# Altium project rocket_main.PrjPcb
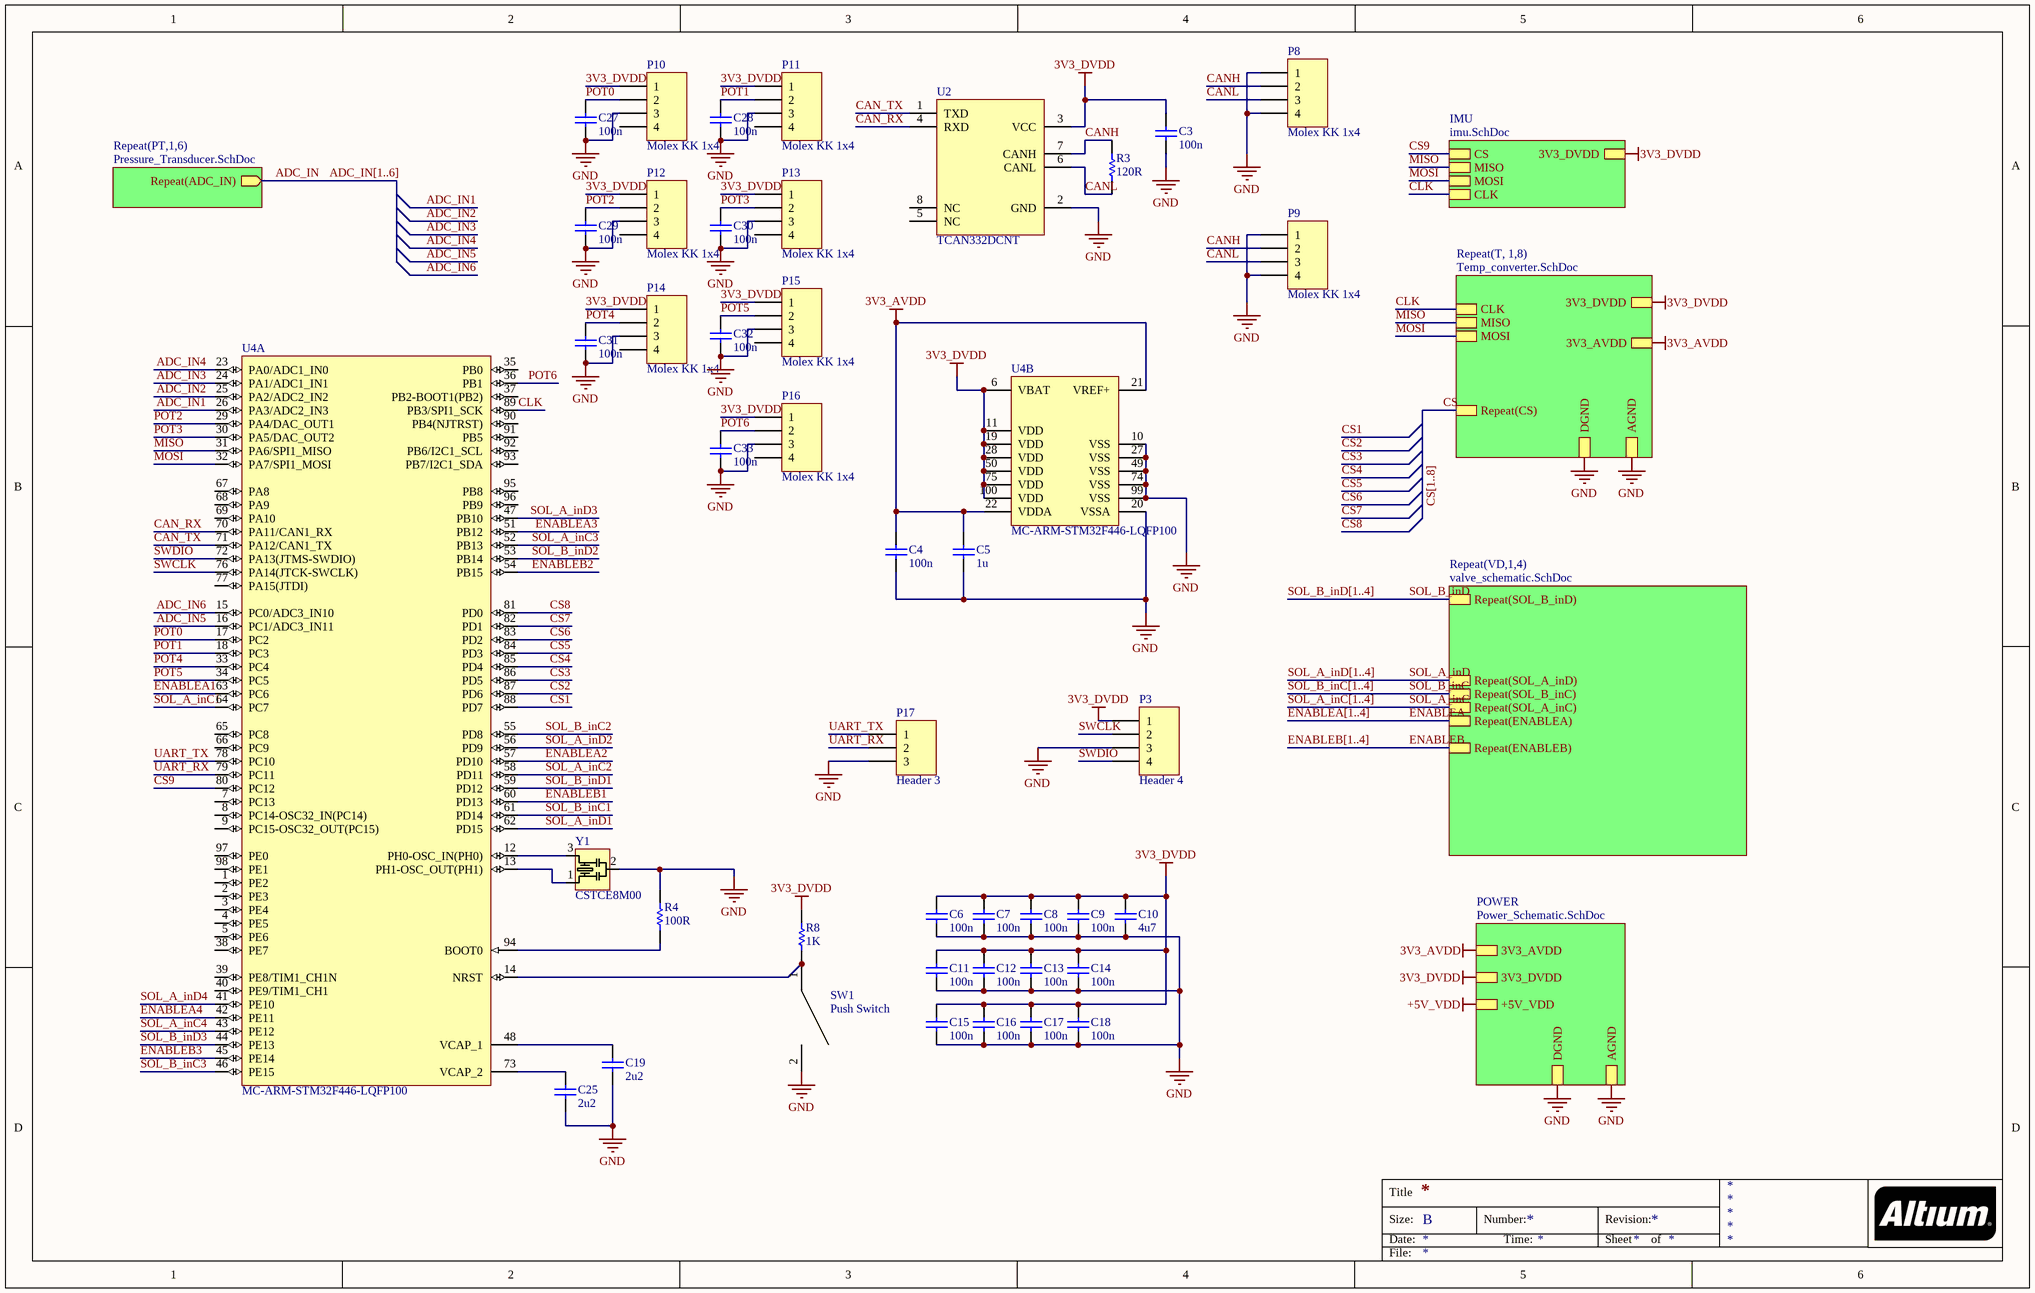
[diagram p0: rocket_main_micro.SchDoc]
6 sheets, 179 parts. Net scope: hierarchical (ports join the sheet entries above them; power ports are global).
Board files: rocket_main.PcbDoc, altiumlogo.PcbDoc
Sheets:
  rocket_main_micro.SchDoc
    T1 = Temp_converter.SchDoc
    T2 = Temp_converter.SchDoc
    T3 = Temp_converter.SchDoc
    T4 = Temp_converter.SchDoc
    T5 = Temp_converter.SchDoc
    T6 = Temp_converter.SchDoc
    T7 = Temp_converter.SchDoc
    T8 = Temp_converter.SchDoc
    PT1 = Pressure_Transducer.SchDoc
    PT2 = Pressure_Transducer.SchDoc
    PT3 = Pressure_Transducer.SchDoc
    PT4 = Pressure_Transducer.SchDoc
    PT5 = Pressure_Transducer.SchDoc
    PT6 = Pressure_Transducer.SchDoc
    VD1 = valve_schematic.SchDoc
    VD2 = valve_schematic.SchDoc
    VD3 = valve_schematic.SchDoc
    VD4 = valve_schematic.SchDoc
    POWER = Power_Schematic.SchDoc
    IMU = imu.SchDoc

## Sheet rocket_main_micro.SchDoc
size B

### Parts
C3  100n  [C0805]
C4  100n  [C0805]
C5  1u  [C0805]
C6  100n  [C0805]
C7  100n  [C0805]
C8  100n  [C0805]
C9  100n  [C0805]
C10  4u7  [C0805]
C11  100n  [C0805]
C12  100n  [C0805]
C13  100n  [C0805]
C14  100n  [C0805]
C15  100n  [C0805]
C16  100n  [C0805]
C17  100n  [C0805]
C18  100n  [C0805]
C19  2u2  [C0805]
C25  2u2  [C0805]
C27  100n  [C0805]
C28  100n  [C0805]
C29  100n  [C0805]
C30  100n  [C0805]
C31  100n  [C0805]
C32  100n  [C0805]
C33  100n  [C0805]
P3  Header 4  [HDR1X4]
P8  Molex KK 1x4  [Molex KK 4x1]
P9  Molex KK 1x4  [Molex KK 4x1]
P10  Molex KK 1x4  [Molex KK 4x1]
P11  Molex KK 1x4  [Molex KK 4x1]
P12  Molex KK 1x4  [Molex KK 4x1]
P13  Molex KK 1x4  [Molex KK 4x1]
P14  Molex KK 1x4  [Molex KK 4x1]
P15  Molex KK 1x4  [Molex KK 4x1]
P16  Molex KK 1x4  [Molex KK 4x1]
P17  Header 3  [HDR1X3]
R3  120R  [R0805]
R4  100R  [R0805]
R8  1K  [R0805]
SW1  Push Switch  [PUSHBUTTON]
U2  TCAN332DCNT  [SOT-23-8]
U4  MC-ARM-STM32F446-LQFP100  [STM-LQFP100_N]  (parts A,B of 2)
Y1  CSTCE8M00  [8MHz Ceramic Resonator]

### Sub-sheets
IMU = imu.SchDoc: CS, 3V3_DVDD, MISO, MOSI, CLK
POWER = Power_Schematic.SchDoc: 3V3_DVDD, 3V3_AVDD, DGND, AGND, +5V_VDD
Repeat(PT,1,6) = Pressure_Transducer.SchDoc: Repeat(ADC_IN) (out)
Repeat(T, 1,8) = Temp_converter.SchDoc: AGND, MOSI, DGND, Repeat(CS), 3V3_DVDD, MISO, 3V3_AVDD, CLK
Repeat(VD,1,4) = valve_schematic.SchDoc: Repeat(SOL_B_inD), Repeat(SOL_A_inD), Repeat(SOL_B_inC), Repeat(SOL_A_inC), Repeat(ENABLEA), Repeat(ENABLEB)

### Nets
3V3_AVDD: C4.1 C5.1 U4.21(VREF+) U4.22(VDDA) ; sheet Repeat(T, 1,8)/3V3_AVDD, sheet POWER/3V3_AVDD
3V3_DVDD: C3.1 C6.1 C7.1 C8.1 C9.1 C10.1 C11.1 C12.1 C13.1 C14.1 C15.1 C16.1 C17.1 C18.1 P3.1 P10.1 P11.1 P12.1 P13.1 P14.1 P15.1 P16.1 R8.2 U2.3(VCC) U4.6(VBAT) U4.11(VDD) U4.19(VDD) U4.28(VDD) U4.50(VDD) U4.75(VDD) U4.100(VDD) ; sheet Repeat(T, 1,8)/3V3_DVDD, sheet POWER/3V3_DVDD, sheet IMU/3V3_DVDD
GND: C3.2 C4.2 C5.2 C6.2 C7.2 C8.2 C9.2 C10.2 C11.2 C12.2 C13.2 C14.2 C15.2 C16.2 C17.2 C18.2 C19.2 C25.2 C27.2 C28.2 C29.2 C30.2 C31.2 C32.2 C33.2 P3.3 P8.1 P8.4 P9.1 P9.4 P10.3 P11.3 P12.3 P13.3 P14.3 P15.3 P16.3 P17.3 R4.2 SW1.2 U2.2(GND) U4.10(VSS) U4.20(VSSA) U4.27(VSS) U4.49(VSS) U4.74(VSS) U4.99(VSS) Y1.2(GND) ; sheet Repeat(T, 1,8)/AGND, sheet Repeat(T, 1,8)/DGND, sheet POWER/DGND, sheet POWER/AGND
ADC_IN: sheet Repeat(PT,1,6)/Repeat(ADC_IN)
ADC_IN1: U4.26(PA3/ADC2_IN3)
ADC_IN2: U4.25(PA2/ADC2_IN2)
ADC_IN3: U4.24(PA1/ADC1_IN1)
ADC_IN4: U4.23(PA0/ADC1_IN0)
ADC_IN5: U4.16(PC1/ADC3_IN11)
ADC_IN6: U4.15(PC0/ADC3_IN10)
CAN_RX: U2.4(RXD) U4.70(PA11/CAN1_RX)
CAN_TX: U2.1(TXD) U4.71(PA12/CAN1_TX)
CANH: P8.2 P9.2 R3.2 U2.7(CANH)
CANL: P8.3 P9.3 R3.1 U2.6(CANL)
CLK: U4.89(PB3/SPI1_SCK) ; sheet Repeat(T, 1,8)/CLK, sheet IMU/CLK
CS: sheet Repeat(T, 1,8)/Repeat(CS)
CS1: U4.88(PD7)
CS2: U4.87(PD6)
CS3: U4.86(PD5)
CS4: U4.85(PD4)
CS5: U4.84(PD3)
CS6: U4.83(PD2)
CS7: U4.82(PD1)
CS8: U4.81(PD0)
CS9: U4.80(PC12) ; sheet IMU/CS
ENABLEA: sheet Repeat(VD,1,4)/Repeat(ENABLEA)
ENABLEA1: U4.63(PC6)  [project net ENABLEA]
ENABLEA2: U4.57(PD10)  [project net ENABLEA]
ENABLEA3: U4.51(PB12)  [project net ENABLEA]
ENABLEA4: U4.42(PE11)  [project net ENABLEA]
ENABLEB: sheet Repeat(VD,1,4)/Repeat(ENABLEB)
ENABLEB1: U4.60(PD13)  [project net ENABLEB]
ENABLEB2: U4.54(PB15)  [project net ENABLEB]
ENABLEB3: U4.45(PE14)  [project net ENABLEB]
MISO: U4.31(PA6/SPI1_MISO) ; sheet Repeat(T, 1,8)/MISO, sheet IMU/MISO
MOSI: U4.32(PA7/SPI1_MOSI) ; sheet Repeat(T, 1,8)/MOSI, sheet IMU/MOSI
POT0: C27.1 P10.2 U4.17(PC2)
POT1: C28.1 P11.2 U4.18(PC3)
POT2: C29.1 P12.2 U4.29(PA4/DAC_OUT1)
POT3: C30.1 P13.2 U4.30(PA5/DAC_OUT2)
POT4: C31.1 P14.2 U4.33(PC4)
POT5: C32.1 P15.2 U4.34(PC5)
POT6: C33.1 P16.2 U4.36(PB1)
SOL_A_inC: sheet Repeat(VD,1,4)/Repeat(SOL_A_inC)
SOL_A_inC1: U4.64(PC7)  [project net SOL_A_inC]
SOL_A_inC2: U4.58(PD11)  [project net SOL_A_inC]
SOL_A_inC3: U4.52(PB13)  [project net SOL_A_inC]
SOL_A_inC4: U4.43(PE12)  [project net SOL_A_inC]
SOL_A_inD: sheet Repeat(VD,1,4)/Repeat(SOL_A_inD)
SOL_A_inD1: U4.62(PD15)  [project net SOL_A_inD]
SOL_A_inD2: U4.56(PD9)  [project net SOL_A_inD]
SOL_A_inD3: U4.47(PB10)  [project net SOL_A_inD]
SOL_A_inD4: U4.41(PE10)  [project net SOL_A_inD]
SOL_B_inC: sheet Repeat(VD,1,4)/Repeat(SOL_B_inC)
SOL_B_inC1: U4.61(PD14)  [project net SOL_B_inC]
SOL_B_inC2: U4.55(PD8)  [project net SOL_B_inC]
SOL_B_inC3: U4.46(PE15)  [project net SOL_B_inC]
SOL_B_inD: sheet Repeat(VD,1,4)/Repeat(SOL_B_inD)
SOL_B_inD1: U4.59(PD12)  [project net SOL_B_inD]
SOL_B_inD2: U4.53(PB14)  [project net SOL_B_inD]
SOL_B_inD3: U4.44(PE13)  [project net SOL_B_inD]
SWCLK: P3.2 U4.76(PA14(JTCK-SWCLK))
SWDIO: P3.4 U4.72(PA13(JTMS-SWDIO))
UART_RX: P17.2 U4.79(PC11)
UART_TX: P17.1 U4.78(PC10)
NetC19_1: C19.1 U4.48(VCAP_1)
NetC25_1: C25.1 U4.73(VCAP_2)
NetR4_1: R4.1 U4.94(BOOT0)
NetR8_1: R8.1 SW1.1 U4.14(NRST)
NetU4_12: U4.12(PH0-OSC_IN(PH0)) Y1.3(OSC2)
NetU4_13: U4.13(PH1-OSC_OUT(PH1)) Y1.1(OSC1)

Not connected (* = marked no-connect by the designer): P10 4; P11 4; P12 4; P13 4; P14 4; P15 4; P16 4; U2 5(NC) 8(NC); U4 1(PE2) 2(PE3) 3(PE4) 4(PE5) 5(PE6) 7(PC13) 8(PC14-OSC32_IN(PC14)) 9(PC15-OSC32_OUT(PC15)) 35(PB0) 37(PB2-BOOT1(PB2)) 38(PE7) 39(PE8/TIM1_CH1N) 40(PE9/TIM1_CH1) 65(PC8) 66(PC9) 67(PA8) 68(PA9) 69(PA10) 77(PA15(JTDI)) 90(PB4(NJTRST)) 91(PB5) 92(PB6/I2C1_SCL) 93(PB7/I2C1_SDA) 95(PB8) 96(PB9) 97(PE0) 98(PE1)

### Buses and harness runs
bus ADC_IN[1..6]
bus CS[1..8]
bus ENABLEA[1..4]
bus ENABLEB[1..4]
bus SOL_A_inC[1..4]
bus SOL_A_inD[1..4]
bus SOL_B_inC[1..4]
bus SOL_B_inD[1..4]

### Notes on the sheet
- Title
- Size:
- Date:
- B
- Number:
- Time:
- Revision:
- Sheet
- of
- File:

### Library data of the parts
C3-C19 C25 C27-C33 = C0805: 0805 Capacitor
  C3 C4 C6-C9 C11-C18 C27-C33: Value: 100n
  C5: Value: 1u
  C10: Value: 4u7
  C19 C25: Value: 2u2
P3 = Header 4: Header, 4-Pin; LatestRevisionDate: 17-Jul-2002; LatestRevisionNote: Re-released for DXP Platform.; Publisher: Altium Limited
P8-P16 = Molex KK 1x4: 1x4 Molex KK Connector
P17 = Header 3: Header, 3-Pin; LatestRevisionDate: 17-Jul-2002; LatestRevisionNote: Re-released for DXP Platform.; Publisher: Altium Limited
R3 R4 R8 = R0805: RESISTOR 0805
  R3: Value: 120R
  R4: Value: 100R
  R8: Value: 1K
SW1 = PUSHBUTTON
U2 = TCAN332DCNT: IC TXRX CAN 3.3V SOT23-8
Y1 = CSTCE8M00: 8MHz Ceramic Resonator

## Sheet Temp_converter.SchDoc
size A
Used 8 times, as channels T1, T2, T3, T4, T5, T6, T7, T8. Parts and nets are listed once, with the designators drawn on the sheet.
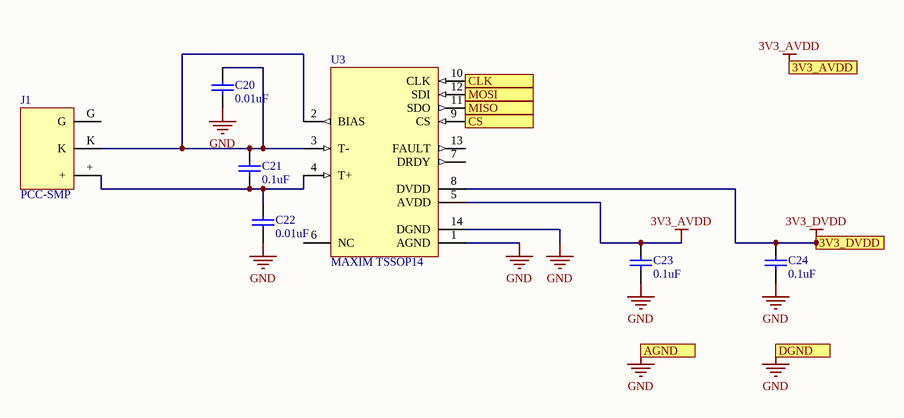
[diagram p1: Temp_converter.SchDoc]

### Parts
C20  0.01uF  [C0805]
C21  0.1uF  [C0805]
C22  0.01uF  [C0805]
C23  0.1uF  [C0805]
C24  0.1uF  [C0805]
J1  PCC-SMP  [PCC-SMP]
U3  MAXIM TSSOP14  [MAXIM TSSOP14]

### Ports
3V3_AVDD, 3V3_DVDD, AGND, CLK, CS, DGND, MISO, MOSI

### Nets
3V3_AVDD: C23.1 U3.5(AVDD) ; port 3V3_AVDD
3V3_DVDD: C24.1 U3.8(DVDD) ; port 3V3_DVDD
GND: C20.2 C22.2 C23.2 C24.2 U3.1(AGND) U3.14(DGND) ; port AGND, port DGND
CLK: U3.10(CLK) ; port CLK
CS: U3.9(CS) ; port CS
MISO: U3.11(SDO) ; port MISO
MOSI: U3.12(SDI) ; port MOSI
NetC20_1: C20.1 C21.1 J1.K U3.2(BIAS) U3.3(T-)
NetC21_2: C21.2 C22.1 J1.+ U3.4(T+)

Not connected (* = marked no-connect by the designer): J1 G; U3 6(NC) 7(DRDY) 13(FAULT)

### Channels
T1: designators end in _T1; ports 3V3_AVDD=3V3_AVDD 3V3_DVDD=3V3_DVDD AGND=GND CLK=CLK CS=CS1 DGND=GND MISO=MISO MOSI=MOSI
T2: designators end in _T2; ports 3V3_AVDD=3V3_AVDD 3V3_DVDD=3V3_DVDD AGND=GND CLK=CLK CS=CS2 DGND=GND MISO=MISO MOSI=MOSI
T3: designators end in _T3; ports 3V3_AVDD=3V3_AVDD 3V3_DVDD=3V3_DVDD AGND=GND CLK=CLK CS=CS3 DGND=GND MISO=MISO MOSI=MOSI
T4: designators end in _T4; ports 3V3_AVDD=3V3_AVDD 3V3_DVDD=3V3_DVDD AGND=GND CLK=CLK CS=CS4 DGND=GND MISO=MISO MOSI=MOSI
T5: designators end in _T5; ports 3V3_AVDD=3V3_AVDD 3V3_DVDD=3V3_DVDD AGND=GND CLK=CLK CS=CS5 DGND=GND MISO=MISO MOSI=MOSI
T6: designators end in _T6; ports 3V3_AVDD=3V3_AVDD 3V3_DVDD=3V3_DVDD AGND=GND CLK=CLK CS=CS6 DGND=GND MISO=MISO MOSI=MOSI
T7: designators end in _T7; ports 3V3_AVDD=3V3_AVDD 3V3_DVDD=3V3_DVDD AGND=GND CLK=CLK CS=CS7 DGND=GND MISO=MISO MOSI=MOSI
T8: designators end in _T8; ports 3V3_AVDD=3V3_AVDD 3V3_DVDD=3V3_DVDD AGND=GND CLK=CLK CS=CS8 DGND=GND MISO=MISO MOSI=MOSI

### Library data of the parts
C20-C24 = C0805: 0805 Capacitor
  C20 C22: Value: 0.01uF
  C21 C23 C24: Value: 0.1uF
J1 = PCC-SMP: THERMOCOUPLE CONNECTOR

## Sheet Pressure_Transducer.SchDoc
size A
Used 6 times, as channels PT1, PT2, PT3, PT4, PT5, PT6. Parts and nets are listed once, with the designators drawn on the sheet.
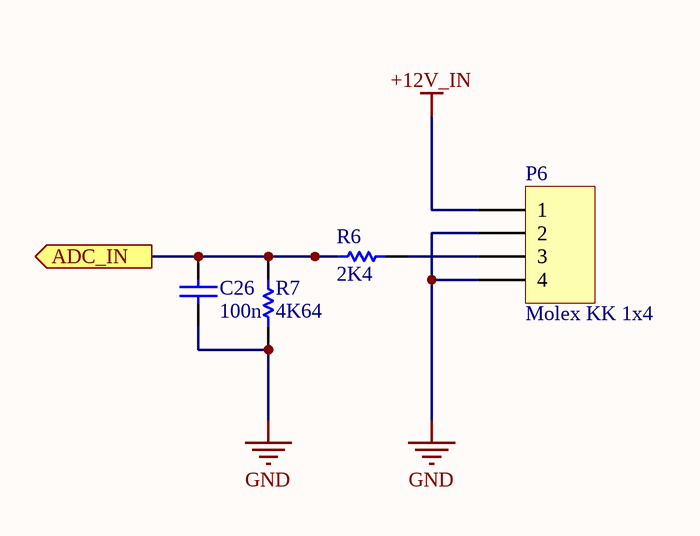
[diagram p2: Pressure_Transducer.SchDoc]

### Parts
C26  100n  [C0805]
P6  Molex KK 1x4  [Molex KK 4x1]
R6  2K4  [R0805]
R7  4K64  [R0805]

### Ports
ADC_IN (out)

### Nets
+12V_IN: P6.1
GND: C26.2 P6.2 P6.4 R7.1
ADC_IN: C26.1 R6.2 R7.2 ; port ADC_IN
NetP6_3: P6.3 R6.1

### Channels
PT1: designators end in _PT1; ports ADC_IN=ADC_IN1
PT2: designators end in _PT2; ports ADC_IN=ADC_IN2
PT3: designators end in _PT3; ports ADC_IN=ADC_IN3
PT4: designators end in _PT4; ports ADC_IN=ADC_IN4
PT5: designators end in _PT5; ports ADC_IN=ADC_IN5
PT6: designators end in _PT6; ports ADC_IN=ADC_IN6

### Library data of the parts
C26 = C0805: 0805 Capacitor; Value: 100n
P6 = Molex KK 1x4: 1x4 Molex KK Connector
R6 R7 = R0805: RESISTOR 0805
  R6: Value: 2K4
  R7: Value: 4K64

## Sheet valve_schematic.SchDoc
size A
Used 4 times, as channels VD1, VD2, VD3, VD4. Parts and nets are listed once, with the designators drawn on the sheet.
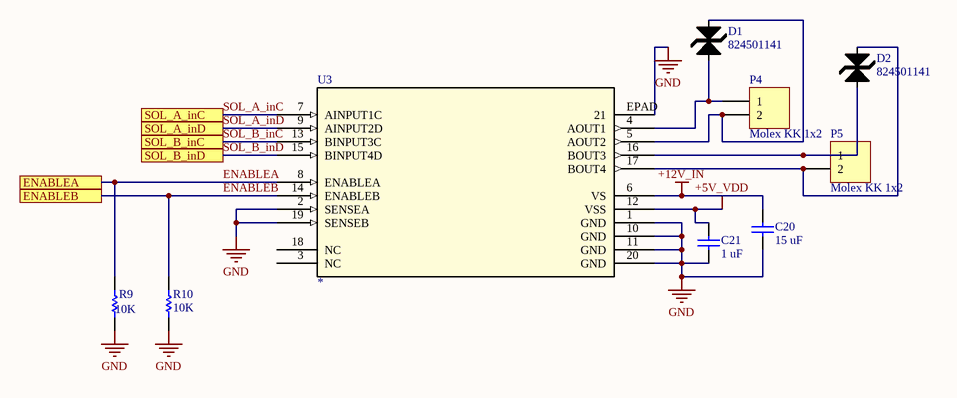
[diagram p3: valve_schematic.SchDoc]

### Parts
C20  15 uF  [C0603]
C21  1 uF  [C0603]
D1  824501141  [DIODE-SMA]
D2  824501141  [DIODE-SMA]
P4  Molex KK 1x2  [Molex KK 2x1]
P5  Molex KK 1x2  [Molex KK 2x1]
R9  10K  [R0805]
R10  10K  [R0805]
U3  *  [PowerSO-20]

### Ports
ENABLEA, ENABLEB, SOL_A_inC, SOL_A_inD, SOL_B_inC, SOL_B_inD

### Nets
+5V_VDD: C21.1 U3.12(VSS)
+12V_IN: C20.1 U3.6(VS)
GND: C20.2 C21.2 R9.1 R10.1 U3.1(GND) U3.2(SENSEA) U3.10(GND) U3.11(GND) U3.19(SENSEB) U3.20(GND) U3.EPAD(21)
ENABLEA: R9.2 U3.8(ENABLEA) ; port ENABLEA
ENABLEB: R10.2 U3.14(ENABLEB) ; port ENABLEB
SOL_A_inC: U3.7(AINPUT1C) ; port SOL_A_inC
SOL_A_inD: U3.9(AINPUT2D) ; port SOL_A_inD
SOL_B_inC: U3.13(BINPUT3C) ; port SOL_B_inC
SOL_B_inD: U3.15(BINPUT4D) ; port SOL_B_inD
NetD1_A: D1.A P4.1 U3.4(AOUT1)
NetD1_K: D1.K P4.2 U3.5(AOUT2)
NetD2_A: D2.A P5.1 U3.16(BOUT3)
NetD2_K: D2.K P5.2 U3.17(BOUT4)

Not connected (* = marked no-connect by the designer): U3 3(NC) 18(NC)

### Channels
VD1: designators end in _VD1; ports ENABLEA=ENABLEA ENABLEB=ENABLEB SOL_A_inC=SOL_A_inC SOL_A_inD=SOL_A_inD SOL_B_inC=SOL_B_inC SOL_B_inD=SOL_B_inD
VD2: designators end in _VD2; ports ENABLEA=ENABLEA ENABLEB=ENABLEB SOL_A_inC=SOL_A_inC SOL_A_inD=SOL_A_inD SOL_B_inC=SOL_B_inC SOL_B_inD=SOL_B_inD
VD3: designators end in _VD3; ports ENABLEA=ENABLEA ENABLEB=ENABLEB SOL_A_inC=SOL_A_inC SOL_A_inD=SOL_A_inD SOL_B_inC=SOL_B_inC SOL_B_inD=SOL_B_inD
VD4: designators end in _VD4; ports ENABLEA=ENABLEA ENABLEB=ENABLEB_VD4 SOL_A_inC=SOL_A_inC SOL_A_inD=SOL_A_inD SOL_B_inC=SOL_B_inC_VD4 SOL_B_inD=SOL_B_inD_VD4

### Library data of the parts
C20 C21 = C0603: 0603 Capacitor
  C20: Value: 15 uF
  C21: Value: 1 uF
D1 D2 = 824501141: TVS DIODE 14V 23.2V DO214AC; Supplier 1: Digi-Key; Supplier Part Number 1: SMCJ120CABTR-ND
P4 P5 = Molex KK 1x2: 1x2 Molex KK Connector
R9 R10 = R0805: RESISTOR 0805; Value: 10K
U3 = L298P013TR: Imported; Vendor: ST Microelectronics; Built_By: EMA_UL_Team; C: Copyright (C) 2015 Accelerated Designs. All rights reserved; Manufacturer_Part_Number: L298P013TR; Value: Value; Type: Type; RefDes: RefDes

## Sheet Power_Schematic.SchDoc
size A
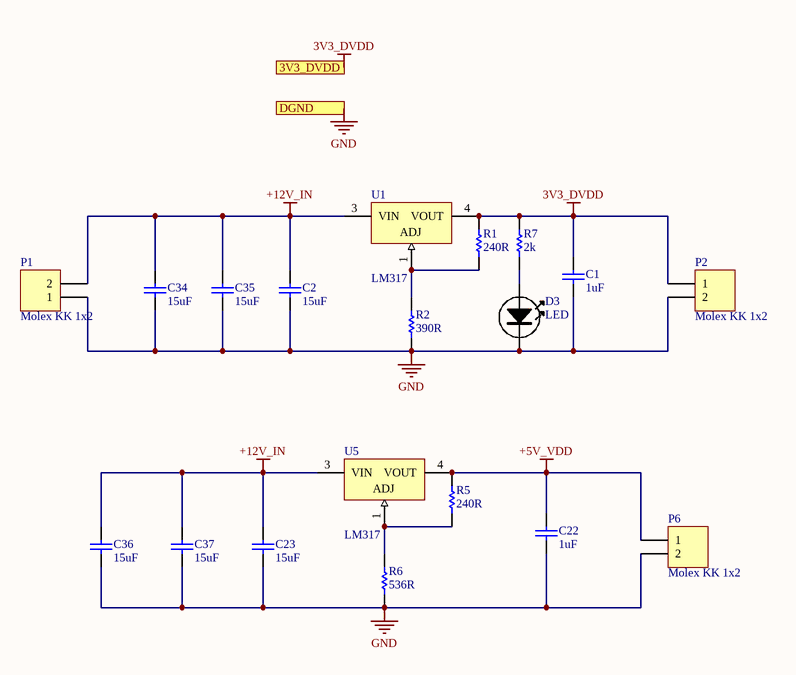
[diagram p4: Power_Schematic.SchDoc]

### Parts
C1  1uF  [C0805]
C2  15uF  [C0805]
C22  1uF  [C0805]
C23  15uF  [C0805]
C34  15uF  [C0805]
C35  15uF  [C0805]
C36  15uF  [C0805]
C37  15uF  [C0805]
D3  LED  [0805LED]
P1  Molex KK 1x2  [Molex KK 2x1]
P2  Molex KK 1x2  [Molex KK 2x1]
P6  Molex KK 1x2  [Molex KK 2x1]
R1  240R  [R0805]
R2  390R  [R0805]
R5  240R  [R0805]
R6  536R  [R0805]
R7  2k  [R0805]
U1  LM317  [D-PAK]
U5  LM317  [D-PAK]

### Ports
3V3_DVDD, DGND

### Nets
3V3_DVDD: C1.1 P2.1 R1.2 R7.2 U1.4(VOUT) ; port 3V3_DVDD
+5V_VDD: C22.1 P6.1 R5.2 U5.4(VOUT)
+12V_IN: C2.1 C23.1 C34.1 C35.1 C36.1 C37.1 P1.2 U1.3(VIN) U5.3(VIN)
GND: C1.2 C2.2 C22.2 C23.2 C34.2 C35.2 C36.2 C37.2 D3.K P1.1 P2.2 P6.2 R2.1 R6.1 ; port DGND
NetD3_A: D3.A R7.1
NetR1_1: R1.1 R2.2 U1.1(ADJ)
NetR5_1: R5.1 R6.2 U5.1(ADJ)

### Library data of the parts
C1 C2 C22 C23 C34-C37 = C0805: 0805 Capacitor
  C1 C22: Value: 1uF
  C2 C23 C34-C37: Value: 15uF
D3 = LED: Manufacturer: OSRAM Opto Semiconductors Inc; Manufacturer Part Number: LS T676-Q1R2-1-Z; Reel: D13
P1 P2 P6 = Molex KK 1x2: 1x2 Molex KK Connector
R1 R2 R5-R7 = R0805: RESISTOR 0805
  R1 R5: Value: 240R
  R2: Value: 390R
  R6: Value: 536R
  R7: Value: 2k
U1 U5 = LM317: Linear Voltage Regulator

## Sheet imu.SchDoc
size A
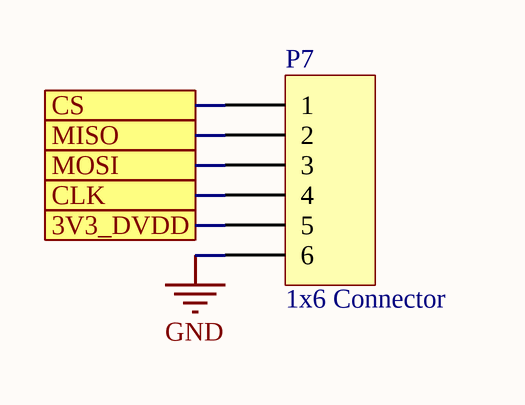
[diagram p5: imu.SchDoc]

### Parts
P7  1x6 Connector  [Molex KK 6x1]

### Ports
3V3_DVDD, CLK, CS, MISO, MOSI

### Nets
3V3_DVDD: P7.5 ; port 3V3_DVDD
GND: P7.6
CLK: P7.4 ; port CLK
CS9: P7.1 ; port CS
MISO: P7.2 ; port MISO
MOSI: P7.3 ; port MOSI

### Library data of the parts
P7 = Molex KK 1x6: 1x6 Molex KK Connector

## Nets that join several sheets
3V3_AVDD: rocket_main_micro (C4.1 C5.1 U4.21 U4.22), T1 (C23_T1.1 U3_T1.5), T2 (C23_T2.1 U3_T2.5), T3 (C23_T3.1 U3_T3.5), T4 (C23_T4.1 U3_T4.5), T5 (C23_T5.1 U3_T5.5), T6 (C23_T6.1 U3_T6.5), T7 (C23_T7.1 U3_T7.5), T8 (C23_T8.1 U3_T8.5)
3V3_DVDD: rocket_main_micro (31 pins), T1 (C24_T1.1 U3_T1.8), T2 (C24_T2.1 U3_T2.8), T3 (C24_T3.1 U3_T3.8), T4 (C24_T4.1 U3_T4.8), T5 (C24_T5.1 U3_T5.8), T6 (C24_T6.1 U3_T6.8), T7 (C24_T7.1 U3_T7.8), T8 (C24_T8.1 U3_T8.8), Power_Schematic (5 pins), imu (P7.5)
+5V_VDD: VD1 (C21_VD1.1 U3_VD1.12), VD2 (C21_VD2.1 U3_VD2.12), VD3 (C21_VD3.1 U3_VD3.12), VD4 (C21_VD4.1 U3_VD4.12), Power_Schematic (C22.1 P6.1 R5.2 U5.4)
+12V_IN: PT1 (P6_PT1.1), PT2 (P6_PT2.1), PT3 (P6_PT3.1), PT4 (P6_PT4.1), PT5 (P6_PT5.1), PT6 (P6_PT6.1), VD1 (C20_VD1.1 U3_VD1.6), VD2 (C20_VD2.1 U3_VD2.6), VD3 (C20_VD3.1 U3_VD3.6), VD4 (C20_VD4.1 U3_VD4.6), Power_Schematic (9 pins)
GND: rocket_main_micro (48 pins), T1 (6 pins), T2 (6 pins), T3 (6 pins), T4 (6 pins), T5 (6 pins), T6 (6 pins), T7 (6 pins), T8 (6 pins), PT1 (C26_PT1.2 P6_PT1.2 P6_PT1.4 R7_PT1.1), PT2 (C26_PT2.2 P6_PT2.2 P6_PT2.4 R7_PT2.1), PT3 (C26_PT3.2 P6_PT3.2 P6_PT3.4 R7_PT3.1), PT4 (C26_PT4.2 P6_PT4.2 P6_PT4.4 R7_PT4.1), PT5 (C26_PT5.2 P6_PT5.2 P6_PT5.4 R7_PT5.1), PT6 (C26_PT6.2 P6_PT6.2 P6_PT6.4 R7_PT6.1), VD1 (11 pins), VD2 (11 pins), VD3 (11 pins), VD4 (11 pins), Power_Schematic (14 pins), imu (P7.6)
ADC_IN1: rocket_main_micro (U4.26), PT1 (C26_PT1.1 R6_PT1.2 R7_PT1.2)
ADC_IN2: rocket_main_micro (U4.25), PT2 (C26_PT2.1 R6_PT2.2 R7_PT2.2)
ADC_IN3: rocket_main_micro (U4.24), PT3 (C26_PT3.1 R6_PT3.2 R7_PT3.2)
ADC_IN4: rocket_main_micro (U4.23), PT4 (C26_PT4.1 R6_PT4.2 R7_PT4.2)
ADC_IN5: rocket_main_micro (U4.16), PT5 (C26_PT5.1 R6_PT5.2 R7_PT5.2)
ADC_IN6: rocket_main_micro (U4.15), PT6 (C26_PT6.1 R6_PT6.2 R7_PT6.2)
CLK: rocket_main_micro (U4.89), T1 (U3_T1.10), T2 (U3_T2.10), T3 (U3_T3.10), T4 (U3_T4.10), T5 (U3_T5.10), T6 (U3_T6.10), T7 (U3_T7.10), T8 (U3_T8.10), imu (P7.4)
CS1: rocket_main_micro (U4.88), T1 (U3_T1.9)
CS2: rocket_main_micro (U4.87), T2 (U3_T2.9)
CS3: rocket_main_micro (U4.86), T3 (U3_T3.9)
CS4: rocket_main_micro (U4.85), T4 (U3_T4.9)
CS5: rocket_main_micro (U4.84), T5 (U3_T5.9)
CS6: rocket_main_micro (U4.83), T6 (U3_T6.9)
CS7: rocket_main_micro (U4.82), T7 (U3_T7.9)
CS8: rocket_main_micro (U4.81), T8 (U3_T8.9)
CS9: rocket_main_micro (U4.80), imu (P7.1)
ENABLEA: rocket_main_micro (U4.51), VD3 (R9_VD3.2 U3_VD3.8)
ENABLEA: rocket_main_micro (U4.63), VD1 (R9_VD1.2 U3_VD1.8)
ENABLEA: rocket_main_micro (U4.57), VD2 (R9_VD2.2 U3_VD2.8)
ENABLEA: rocket_main_micro (U4.42), VD4 (R9_VD4.2 U3_VD4.8)
ENABLEB: rocket_main_micro (U4.54), VD2 (R10_VD2.2 U3_VD2.14)
ENABLEB: rocket_main_micro (U4.60), VD1 (R10_VD1.2 U3_VD1.14)
ENABLEB: rocket_main_micro (U4.45), VD3 (R10_VD3.2 U3_VD3.14)
MISO: rocket_main_micro (U4.31), T1 (U3_T1.11), T2 (U3_T2.11), T3 (U3_T3.11), T4 (U3_T4.11), T5 (U3_T5.11), T6 (U3_T6.11), T7 (U3_T7.11), T8 (U3_T8.11), imu (P7.2)
MOSI: rocket_main_micro (U4.32), T1 (U3_T1.12), T2 (U3_T2.12), T3 (U3_T3.12), T4 (U3_T4.12), T5 (U3_T5.12), T6 (U3_T6.12), T7 (U3_T7.12), T8 (U3_T8.12), imu (P7.3)
SOL_A_inC: rocket_main_micro (U4.52), VD3 (U3_VD3.7)
SOL_A_inC: rocket_main_micro (U4.64), VD1 (U3_VD1.7)
SOL_A_inC: rocket_main_micro (U4.58), VD2 (U3_VD2.7)
SOL_A_inC: rocket_main_micro (U4.43), VD4 (U3_VD4.7)
SOL_A_inD: rocket_main_micro (U4.47), VD3 (U3_VD3.9)
SOL_A_inD: rocket_main_micro (U4.62), VD1 (U3_VD1.9)
SOL_A_inD: rocket_main_micro (U4.56), VD2 (U3_VD2.9)
SOL_A_inD: rocket_main_micro (U4.41), VD4 (U3_VD4.9)
SOL_B_inC: rocket_main_micro (U4.61), VD1 (U3_VD1.13)
SOL_B_inC: rocket_main_micro (U4.55), VD2 (U3_VD2.13)
SOL_B_inC: rocket_main_micro (U4.46), VD3 (U3_VD3.13)
SOL_B_inD: rocket_main_micro (U4.53), VD2 (U3_VD2.15)
SOL_B_inD: rocket_main_micro (U4.59), VD1 (U3_VD1.15)
SOL_B_inD: rocket_main_micro (U4.44), VD3 (U3_VD3.15)